# Altium schematic sheet Schematic_altium.SchDoc
size A0
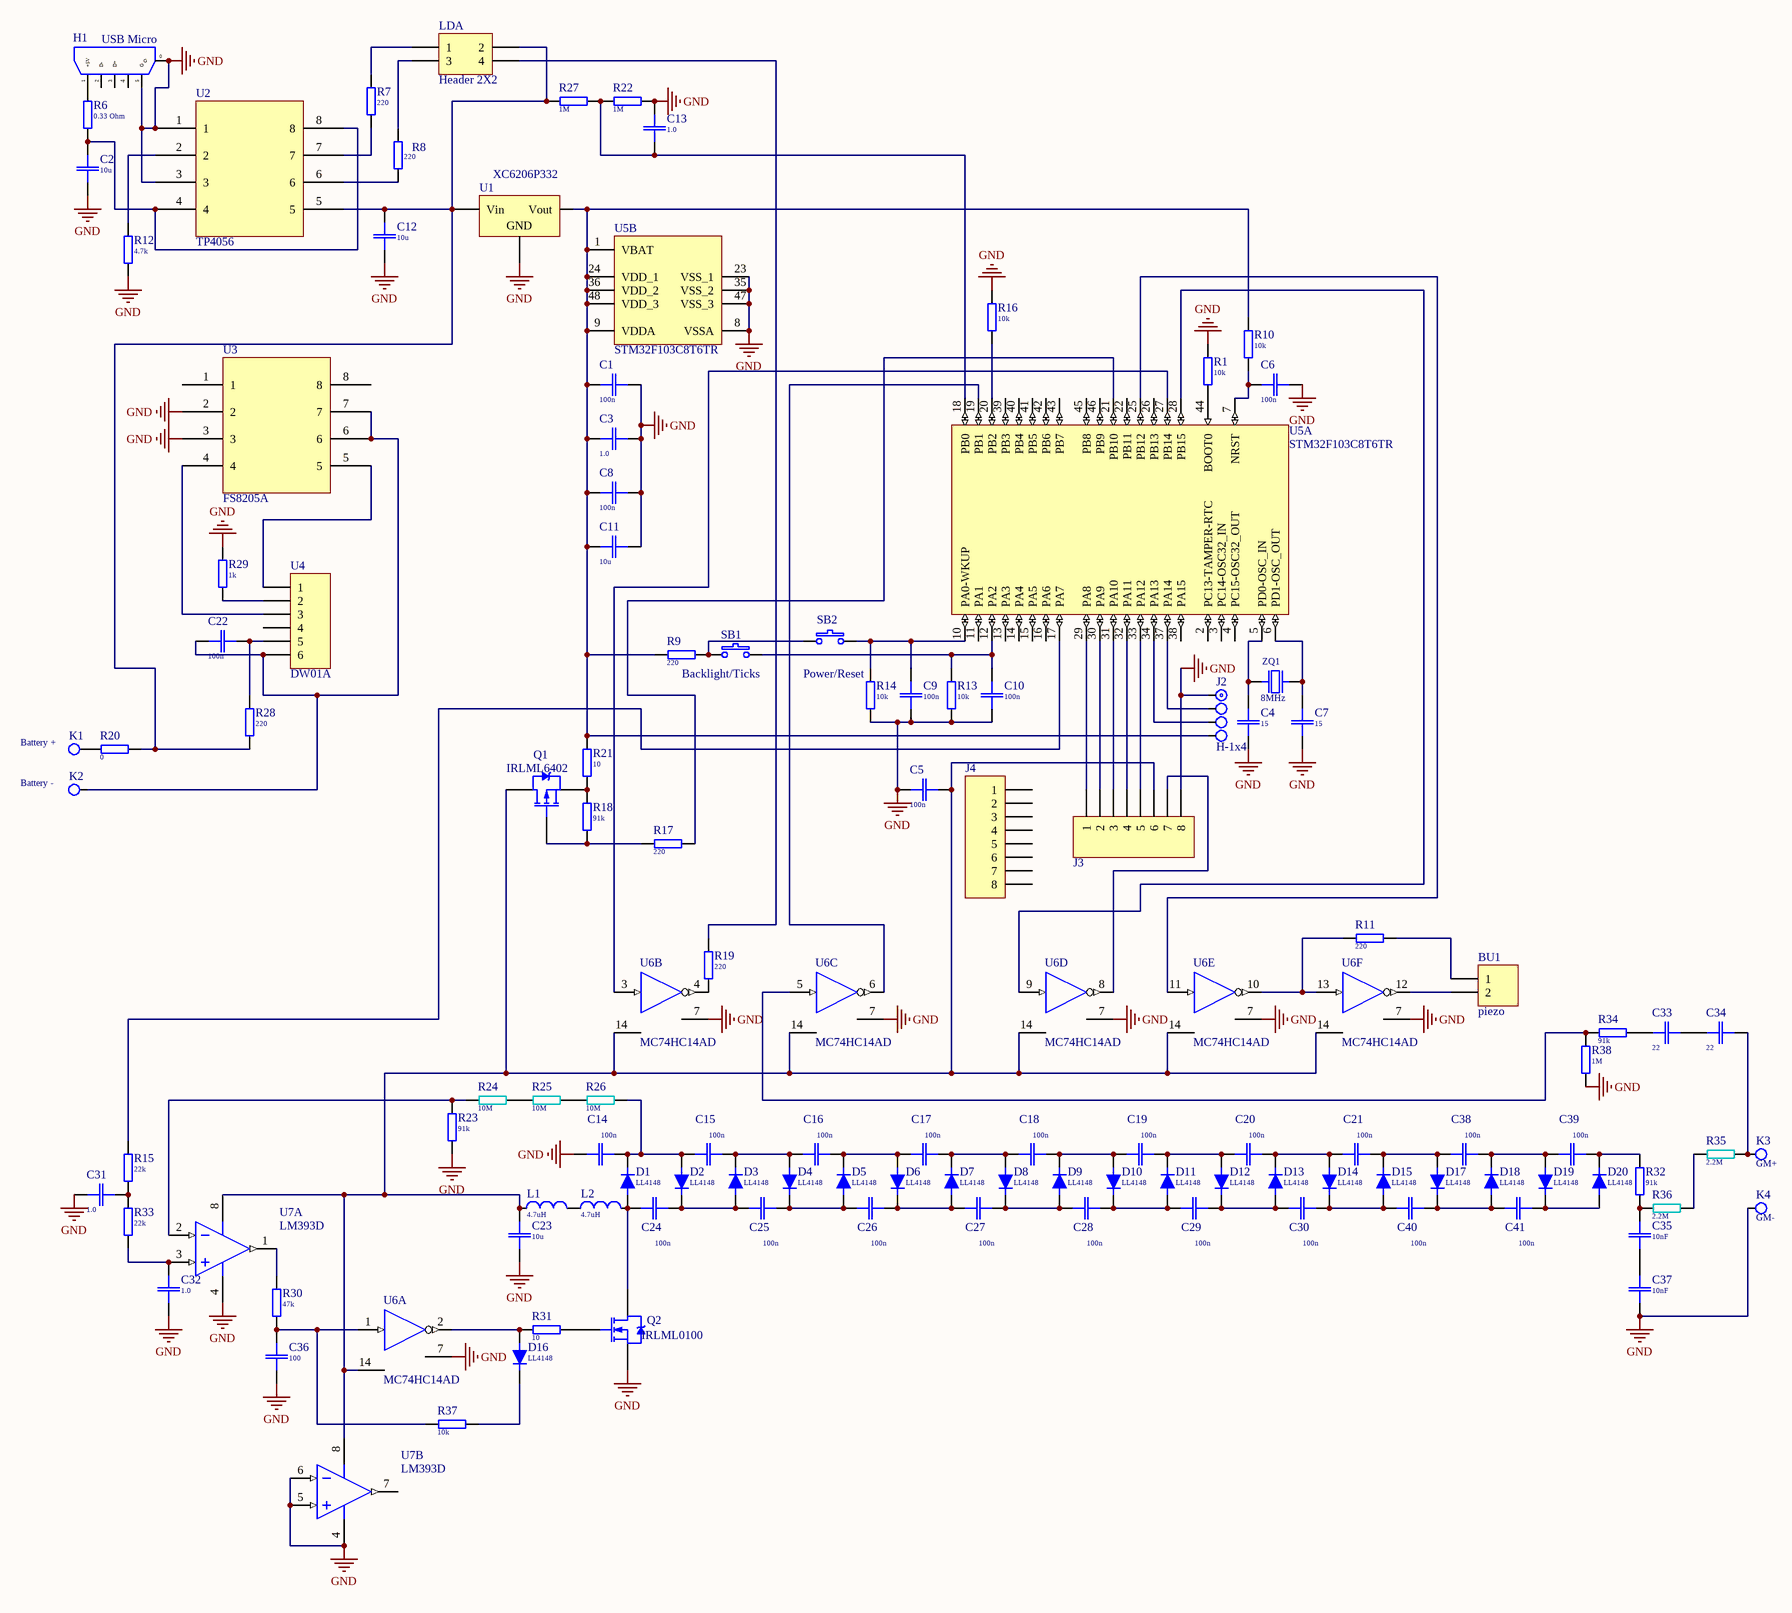
[diagram p0: Schematic_altium.SchDoc]

## Parts
BU1  piezo  [HDR1X2]
C1  100n  [C0805(2013)]
C2  10u  [C1210(3225)]
C3  1.0  [C0805(2013)]
C4  15  [C0805(2013)]
C5  100n  [C0805(2013)]
C6  100n  [C0805(2013)]
C7  15  [C0805(2013)]
C8  100n  [C0805(2013)]
C9  100n  [C0805(2013)]
C10  100n  [C0805(2013)]
C11  10u  [C1210(3225)]
C12  10u  [C1210(3225)]
C13  1.0  [C0805(2013)]
C14  100n  [C0805(2013)]
C15  100n  [C0805(2013)]
C16  100n  [C0805(2013)]
C17  100n  [C0805(2013)]
C18  100n  [C0805(2013)]
C19  100n  [C0805(2013)]
C20  100n  [C0805(2013)]
C21  100n  [C0805(2013)]
C22  100n  [C0805(2013)]
C23  10u  [C1210(3225)]
C24  100n  [C0805(2013)]
C25  100n  [C0805(2013)]
C26  100n  [C0805(2013)]
C27  100n  [C0805(2013)]
C28  100n  [C0805(2013)]
C29  100n  [C0805(2013)]
C30  100n  [C0805(2013)]
C31  1.0  [C0805(2013)]
C32  1.0  [C0805(2013)]
C33  22  [C1210(3225)]
C34  22  [C1210(3225)]
C35  10nF  [C1210(3225)]
C36  100  [C0805(2013)]
C37  10nF  [C1210(3225)]
C38  100n  [C0805(2013)]
C39  100n  [C0805(2013)]
C40  100n  [C0805(2013)]
C41  100n  [C0805(2013)]
D1  LL4148  [SOD80/MLL34]
D2  LL4148  [SOD80/MLL34]
D3  LL4148  [SOD80/MLL34]
D4  LL4148  [SOD80/MLL34]
D5  LL4148  [SOD80/MLL34]
D6  LL4148  [SOD80/MLL34]
D7  LL4148  [SOD80/MLL34]
D8  LL4148  [SOD80/MLL34]
D9  LL4148  [SOD80/MLL34]
D10  LL4148  [SOD80/MLL34]
D11  LL4148  [SOD80/MLL34]
D12  LL4148  [SOD80/MLL34]
D13  LL4148  [SOD80/MLL34]
D14  LL4148  [SOD80/MLL34]
D15  LL4148  [SOD80/MLL34]
D16  LL4148  [SOD80/MLL34]
D17  LL4148  [SOD80/MLL34]
D18  LL4148  [SOD80/MLL34]
D19  LL4148  [SOD80/MLL34]
D20  LL4148  [SOD80/MLL34]
H1  USB Micro  [USB Micro]
J2  H-1x4  [J1x4]
J3  (no value)  [HDR1X8]
J4  (no value)  [HDR1X8]
K1  Battery +  [F1-2.5]  (no BOM)
K2  Battery -  [F1-2.5]  (no BOM)
K3  GM+  [F1-2.5]  (no BOM)
K4  GM-  [F1-2.5]  (no BOM)
L1  4.7uH  [Dr-SD-75]
L2  4.7uH  [Dr-SD-75]
LDA  Header 2X2  [HDR2X2]
Q1  IRLML6402  [Micro3_N]
Q2  IRLML0100  [SOT-23_N]
R1  10k  [R0805]
R6  0.33 Ohm  [R0805]
R7  220  [R0805]
R8  220  [R0805]
R9  220  [R0805]
R10  10k  [R0805]
R11  220  [R0805]
R12  4.7k  [R0805]
R13  10k  [R0805]
R14  10k  [R0805]
R15  22k  [R0805]
R16  10k  [R0805]
R17  220  [R0805]
R18  91k  [R0805]
R19  220  [R0805]
R20  0  [R0805]
R21  10  [R0805]
R22  1M  [R0805]
R23  91k  [R0805]
R24  10M  [R1206]
R25  10M  [R1206]
R26  10M  [R1206]
R27  1M  [R0805]
R28  220  [R0805]
R29  1k  [R0805]
R30  47k  [R0805]
R31  10  [R0805]
R32  91k  [R0805]
R33  22k  [R0805]
R34  91k  [R0805]
R35  2.2M  [R1206]
R36  2.2M  [R1206]
R37  10k  [R0805]
R38  1M  [R0805]
SB1  Backlight/Ticks  [TS-06]
SB2  Power/Reset  [TS-06]
U1  XC6206P332  [SOT23_N]
U2  TP4056  [751-06_N]
U3  FS8205A  [SOP65P780-8M]
U4  DW01A  [SOT363-6N]
U5  STM32F103C8T6TR  [STM-LQFP64_M]  (parts A,B of 2)
U6  MC74HC14AD  [751A-02_N]  (parts A,B,C,D,E,F of 6)
U7  LM393D  [751-02_N]  (parts A,B of 2)
ZQ1  8MHz  [HC49S]

## Nets
GND: C1.2 C2.2 C3.2 C4.2 C5.1 C6.2 C7.2 C8.2 C9.1 C10.1 C11.2 C12.2 C13.2 C14.1 C23.2 C31.1 C32.1 C36.1 C37.2 H1.0(G) H1.5(G) J2.1 J3.8 K4.1 Q2.2(S) R1.2 R12.1 R13.1 R14.1 R16.2 R22.1 R23.2 R29.2 R38.1 U1.2(GND) U2.1 U2.3 U3.2 U3.3 U5.8(VSSA) U5.23(VSS_1) U5.35(VSS_2) U5.47(VSS_3) U6.7(GND) U7.4(GND) U7.5(IN+) U7.6(IN-)
VDD: C5.2 C23.1 J3.6 L1.1 Q1.3(D) U6.14(VDD) U7.8(V+)
NetBU1_1: BU1.1 R11.1
NetBU1_2: BU1.2 U6.12(Y)
NetC1_1: C1.1 C3.1 C8.1 C11.1 J2.4 R9.2 R10.2 R21.2 U1.3(Vout) U5.1(VBAT) U5.9(VDDA) U5.24(VDD_1) U5.36(VDD_2) U5.48(VDD_3)
NetC2_1: C2.1 R6.1 U2.4 U2.8
NetC4_1: C4.1 U5.5(PD0-OSC_IN) ZQ1.2
NetC6_1: C6.1 R10.1 U5.7(NRST)
NetC7_1: C7.1 U5.6(PD1-OSC_OUT) ZQ1.1
NetC9_2: C9.2 R14.2 SB2.2 U5.10(PA0-WKUP)
NetC10_2: C10.2 R13.2 SB1.2 U5.12(PA2)
NetC12_1: C12.1 LDA.2 R20.1 R27.2 R28.1 U1.1(Vin) U2.5
NetC13_1: C13.1 R22.2 R27.1 U5.18(PB0)
NetC14_2: C14.2 C15.1 D1.2(C) D2.1(A) R26.1
NetC15_2: C15.2 C16.1 D3.2(C) D4.1(A)
NetC16_2: C16.2 C17.1 D5.2(C) D6.1(A)
NetC17_2: C17.2 C18.1 D7.2(C) D8.1(A)
NetC18_2: C18.2 C19.1 D9.2(C) D10.1(A)
NetC19_2: C19.2 C20.1 D11.2(C) D12.1(A)
NetC20_2: C20.2 C21.1 D13.2(C) D14.1(A)
NetC21_2: C21.2 C38.1 D15.2(C) D17.1(A)
NetC22_1: C22.1 K2.1 U3.6 U3.7 U4.6
NetC22_2: C22.2 R28.2 U4.5
NetC24_1: C24.1 D1.1(A) L2.2 Q2.3(D)
NetC24_2: C24.2 C25.1 D2.2(C) D3.1(A)
NetC25_2: C25.2 C26.1 D4.2(C) D5.1(A)
NetC26_2: C26.2 C27.1 D6.2(C) D7.1(A)
NetC27_2: C27.2 C28.1 D8.2(C) D9.1(A)
NetC28_2: C28.2 C29.1 D10.2(C) D11.1(A)
NetC29_2: C29.2 C30.1 D12.2(C) D13.1(A)
NetC30_2: C30.2 C40.1 D14.2(C) D15.1(A)
NetC31_2: C31.2 R15.1 R33.2
NetC32_2: C32.2 R33.1 U7.3(IN+)
NetC33_1: C33.1 R34.1
NetC33_2: C33.2 C34.1
NetC34_2: C34.2 K3.1 R35.1
NetC35_1: C35.1 R32.1 R36.2
NetC35_2: C35.2 C37.1
NetC36_2: C36.2 R30.1 R37.2 U6.1(A)
NetC38_2: C38.2 C39.1 D18.2(C) D19.1(A)
NetC39_2: C39.2 D20.2(C) R32.2
NetC40_2: C40.2 C41.1 D17.2(C) D18.1(A)
NetC41_2: C41.2 D19.2(C) D20.1(A)
NetD16_1: D16.1(A) R31.2 U6.2(Y)
NetD16_2: D16.2(C) R37.1
NetH1_1: H1.1(+5V) R6.2
NetJ2_2: J2.2 U5.37(PA14)
NetJ2_3: J2.3 U5.34(PA13)
NetJ3_1: J3.1 U5.29(PA8)
NetJ3_2: J3.2 U5.30(PA9)
NetJ3_3: J3.3 U5.31(PA10)
NetJ3_4: J3.4 U5.32(PA11)
NetJ3_5: J3.5 U5.33(PA12)
NetJ3_7: J3.7 U6.8(Y)
NetK1_1: K1.1 R20.2
NetL1_2: L1.2 L2.1
NetLDA_1: LDA.1 R7.2
NetLDA_3: LDA.3 R8.2
NetLDA_4: LDA.4 R19.2
NetQ1_1: Q1.1(G) R17.2 R18.1
NetQ1_2: Q1.2(S) R18.2 R21.1
NetQ2_1: Q2.1(G) R31.1
NetR1_1: R1.1 U5.44(BOOT0)
NetR7_1: R7.1 U2.7
NetR8_1: R8.1 U2.6
NetR9_1: R9.1 SB1.1 SB2.1
NetR11_2: R11.2 U6.10(Y) U6.13(A)
NetR12_2: R12.2 U2.2
NetR15_2: R15.2 U5.17(PA7)
NetR16_1: R16.1 U5.20(PB2)
NetR17_1: R17.1 U5.21(PB10)
NetR19_1: R19.1 U6.4(Y)
NetR23_1: R23.1 R24.2 U7.2(IN-)
NetR24_1: R24.1 R25.2
NetR25_1: R25.1 R26.2
NetR29_1: R29.1 U4.2
NetR30_2: R30.2 U7.1(OUT)
NetR34_2: R34.2 R38.2 U6.5(A)
NetR35_2: R35.2 R36.1
NetU3_4: U3.4 U4.3
NetU3_5: U3.5 U4.1
NetU5_19: U5.19(PB1) U6.6(Y)
NetU5_25: U5.25(PB12) U6.11(A)
NetU5_27: U5.27(PB14) U6.3(A)
NetU5_28: U5.28(PB15) U6.9(A)

Not connected (* = marked no-connect by the designer): H1 2(D-) 3(D+) 4; J4 1 2 3 4 5 6 7 8; U3 1 8; U4 4; U5 2(PC13-TAMPER-RTC) 3(PC14-OSC32_IN) 4(PC15-OSC32_OUT) 11(PA1) 13(PA3) 14(PA4) 15(PA5) 16(PA6) 22(PB11) 26(PB13) 38(PA15) 39(PB3) 40(PB4) 41(PB5) 42(PB6) 43(PB7) 45(PB8) 46(PB9); U7 7(OUT)

## Library data of the parts
BU1 = Header 2: Header, 2-Pin; LatestRevisionDate: 17-Jul-2002; LatestRevisionNote: Re-released for DXP Platform.; Publisher: Altium Limited
C1 C3-C10 C13-C22 C24-C32 C36 C38-C41 = C-0805: SMD-0805; Price: 0.014
  C1 C5 C6 C8-C10 C14-C22 C24-C30 C38-C41: Value: 100n
  C3 C13 C31 C32: Value: 1.0
  C4 C7: Value: 15
  C36: Value: 100
C2 C11 C12 C23 C33-C35 C37 = C-1210  100V 2.2u: SMD-1210 100V X7R 10%; Price: 1
  C2 C11 C12 C23: Value: 10u
  C33 C34: Value: 22
  C35 C37: Value: 10nF
D1-D20 = LL4148: 75V 0.3A SOD80/MLL34; Price: 0.006
H1 = USB Micro: USB B Micro R/A SMD; Price: 0.90
J3 J4 = Header 8: Header, 8-Pin; LatestRevisionDate: 17-Jul-2002; LatestRevisionNote: Re-released for DXP Platform.; Publisher: Altium Limited
K1-K4 = K-1-2.5: Price: 0.01
L1 L2 = L-SD-75 33uH: 1.2A 0.15om 7.3x7.3x5mm; Price: 0.85; Value: 4.7uH
LDA = Header 2X2: Header, 2-Pin, Dual row; LatestRevisionDate: 17-Jul-2002; LatestRevisionNote: Re-released for DXP Platform.; Publisher: Altium Limited
Q1 = IRLML6401: HEXFET Power MOSFET; Published: 17-Sep-2003; DatasheetVersion: 2-Jul-2001; PackageVersion: Jul-2001; PackageReference: Micro3; Publisher: Altium Limited; PackageDescription: 3-Pin SOT-23 Package 0.95 mm Pitch, 2.3 mm Lead Span; ComponentLink1Description: Manufacturer Link; ComponentLink1URL: http://www.irf.com/; ComponentLink2Description: Datasheet; ComponentLink2URL: http://www.irf.com/product-info/datasheets/data/IRLML6401.pdf
Q2 = IRLML2402: HEXFET Power MOSFET; Published: 8-Jun-2000; LatestRevisionDate: 20-Nov-2009; LatestRevisionNote: IPC-7351 Footprint Added.; DatasheetVersion: Aug-1997; PackageReference: SOT-23; Publisher: Altium Limited; PackageDescription: 3-Pin SOT-23 Package 0.95 mm Pitch, 2.3 mm Lead Span; ComponentLink1Description: Manufacturer Link; ComponentLink1URL: http://www.irf.com/; ComponentLink2Description: Datasheet; ComponentLink2URL: http://www.irf.com/product-info/datasheets/data/irlml2402.pdf
R1 R6-R23 R27-R34 R37 R38 = R-0805: SMD 0805 0.1W 5% 150V; Price: 0.017
  R1 R10 R13 R14 R16 R37: Value: 10k
  R6: Value: 0.33 Ohm
  R7-R9 R11 R17 R19 R28: Value: 220
  R12: Value: 4.7k
  R15 R33: Value: 22k
  R18 R23 R32 R34: Value: 91k
  R20: Value: 0
  R21 R31: Value: 10
  R22 R27 R38: Value: 1M
  R29: Value: 1k
  R30: Value: 47k
R24-R26 R35 R36 = R-1206: SMD 1206 0.125W 5% 200V; Price: 0.045
  R24-R26: Value: 10M
  R35 R36: Value: 2.2M
SB1 SB2 = Buton TS-06: Price: 0.15
U1 = Volt Reg: Voltage Regulator; Published: 24-Mar-1999; LatestRevisionDate: 29-May-2009; LatestRevisionNote: IPC-7351 Footprint Added.; PackageReference: D2PAK; Publisher: Altium Limited; PackageDescription: 3-Pin Transistor Outline Package 2.54 mm Pitch, 15.1 mm Lead Span
U2 U3 = MP2307
U4 = Header 6: Header, 6-Pin; LatestRevisionDate: 17-Jul-2002; LatestRevisionNote: Re-released for DXP Platform.; Publisher: Altium Limited
U5 = STM32F103C8T6TR: ARM Cortex-M3 32-bit MCU, 64 KB Flash, 20 KB Internal RAM, 37 I/Os, 48-pin LQFP, -40 to 85 degC, Tape and Reel; A/D Converter: 2x12-bit (10 Channel); FLASH Size (Prog) (kB): 64; I/Os (High Current): 37; Internal RAM Size (kB): 20; Operating Frequency(F) (Processor speed) (MHz): 72; Supply Voltage(Vcc) min (V): 2; DatasheetVersion: Rev. 16; PackageVersion: Rev. 6, 06/2013; PackageReference: LQFP48; PackageDescription: 48-Pin Low Profile Quad Flat Package, 7 x 7 mm Body, 0.5 mm Pitch; Supplier 1: Digi-Key; Supplier Part Number 1: STM32F103C8T6TR-ND; Supplier 2: Mouser; Supplier Part Number 2: 511-STM32F103C8T6TR; Core: ARM Cortex-M3; Packing: Tape and Reel; Mounting Technology: Surface Mount; PartNumber: STM32F103C8T6TR; ComponentLink1Description: Manufacturer URL; ComponentLink1URL: http://www.st.com/web/en/home.html; ComponentLink2Description: Datasheet; ComponentLink2URL: http://www.st.com/st-web-ui/static/active/en/resource/technical/document/datasheet/CD00161566.pdf; ComponentLink3Description: Package Specification; ComponentLink3URL: http://www.st.com/st-web-ui/static/active/en/resource/technical/document/datasheet/DM00058181.pdf
U6 = MC74HC14AD: Hex Schmitt Trigger Inverter; Published: 17-Jul-2002; LatestRevisionDate: 13-Apr-2006; LatestRevisionNote: IPC-7351 Footprint Added.; DatasheetVersion: 1989; PackageVersion: 1991; PackageReference: 751A-02; Publisher: Altium Limited; PackageDescription: 14-Pin Small Outline Integrated Circuit 1.27 mm Pitch; Code_IPC: SOIC127P600-14; ComponentLink1Description: Manufacturer Link; ComponentLink1URL: http://www.onsemi.com/site/products/parametrics/0,4446,247,00.html; ComponentLink2Description: Ibis Model; ComponentLink2URL: http://www.onsemi.com/pub/Collateral/MC54HC14AJ.IBS
U7 = LM393D: Dual Comparator; Published: 17-Jul-2002; LatestRevisionDate: 13-Apr-2006; LatestRevisionNote: IPC-7351 Footprint Added.; DatasheetVersion: 1988; PackageReference: 751-02; Publisher: Altium Limited; PackageDescription: 8-Pin Small Outline Integrated Circuit 1.27 mm Pitch; Code_JEDEC: MS-012-AA; Code_IPC: SOIC127P600-8; ComponentLink1Description: Manufacturer Link; ComponentLink1URL: http://www.onsemi.com/site/products/taxonomy/0,4438,133,00.html
ZQ1 = Q: Typ: Qvarz 14.7456 HC49S; Price: 0.45
J2 = H-1x4: Price: 0.04